# EAGLE design ECE411 V1.06 Final Draft OshPark (EAGLE 9.6.2)
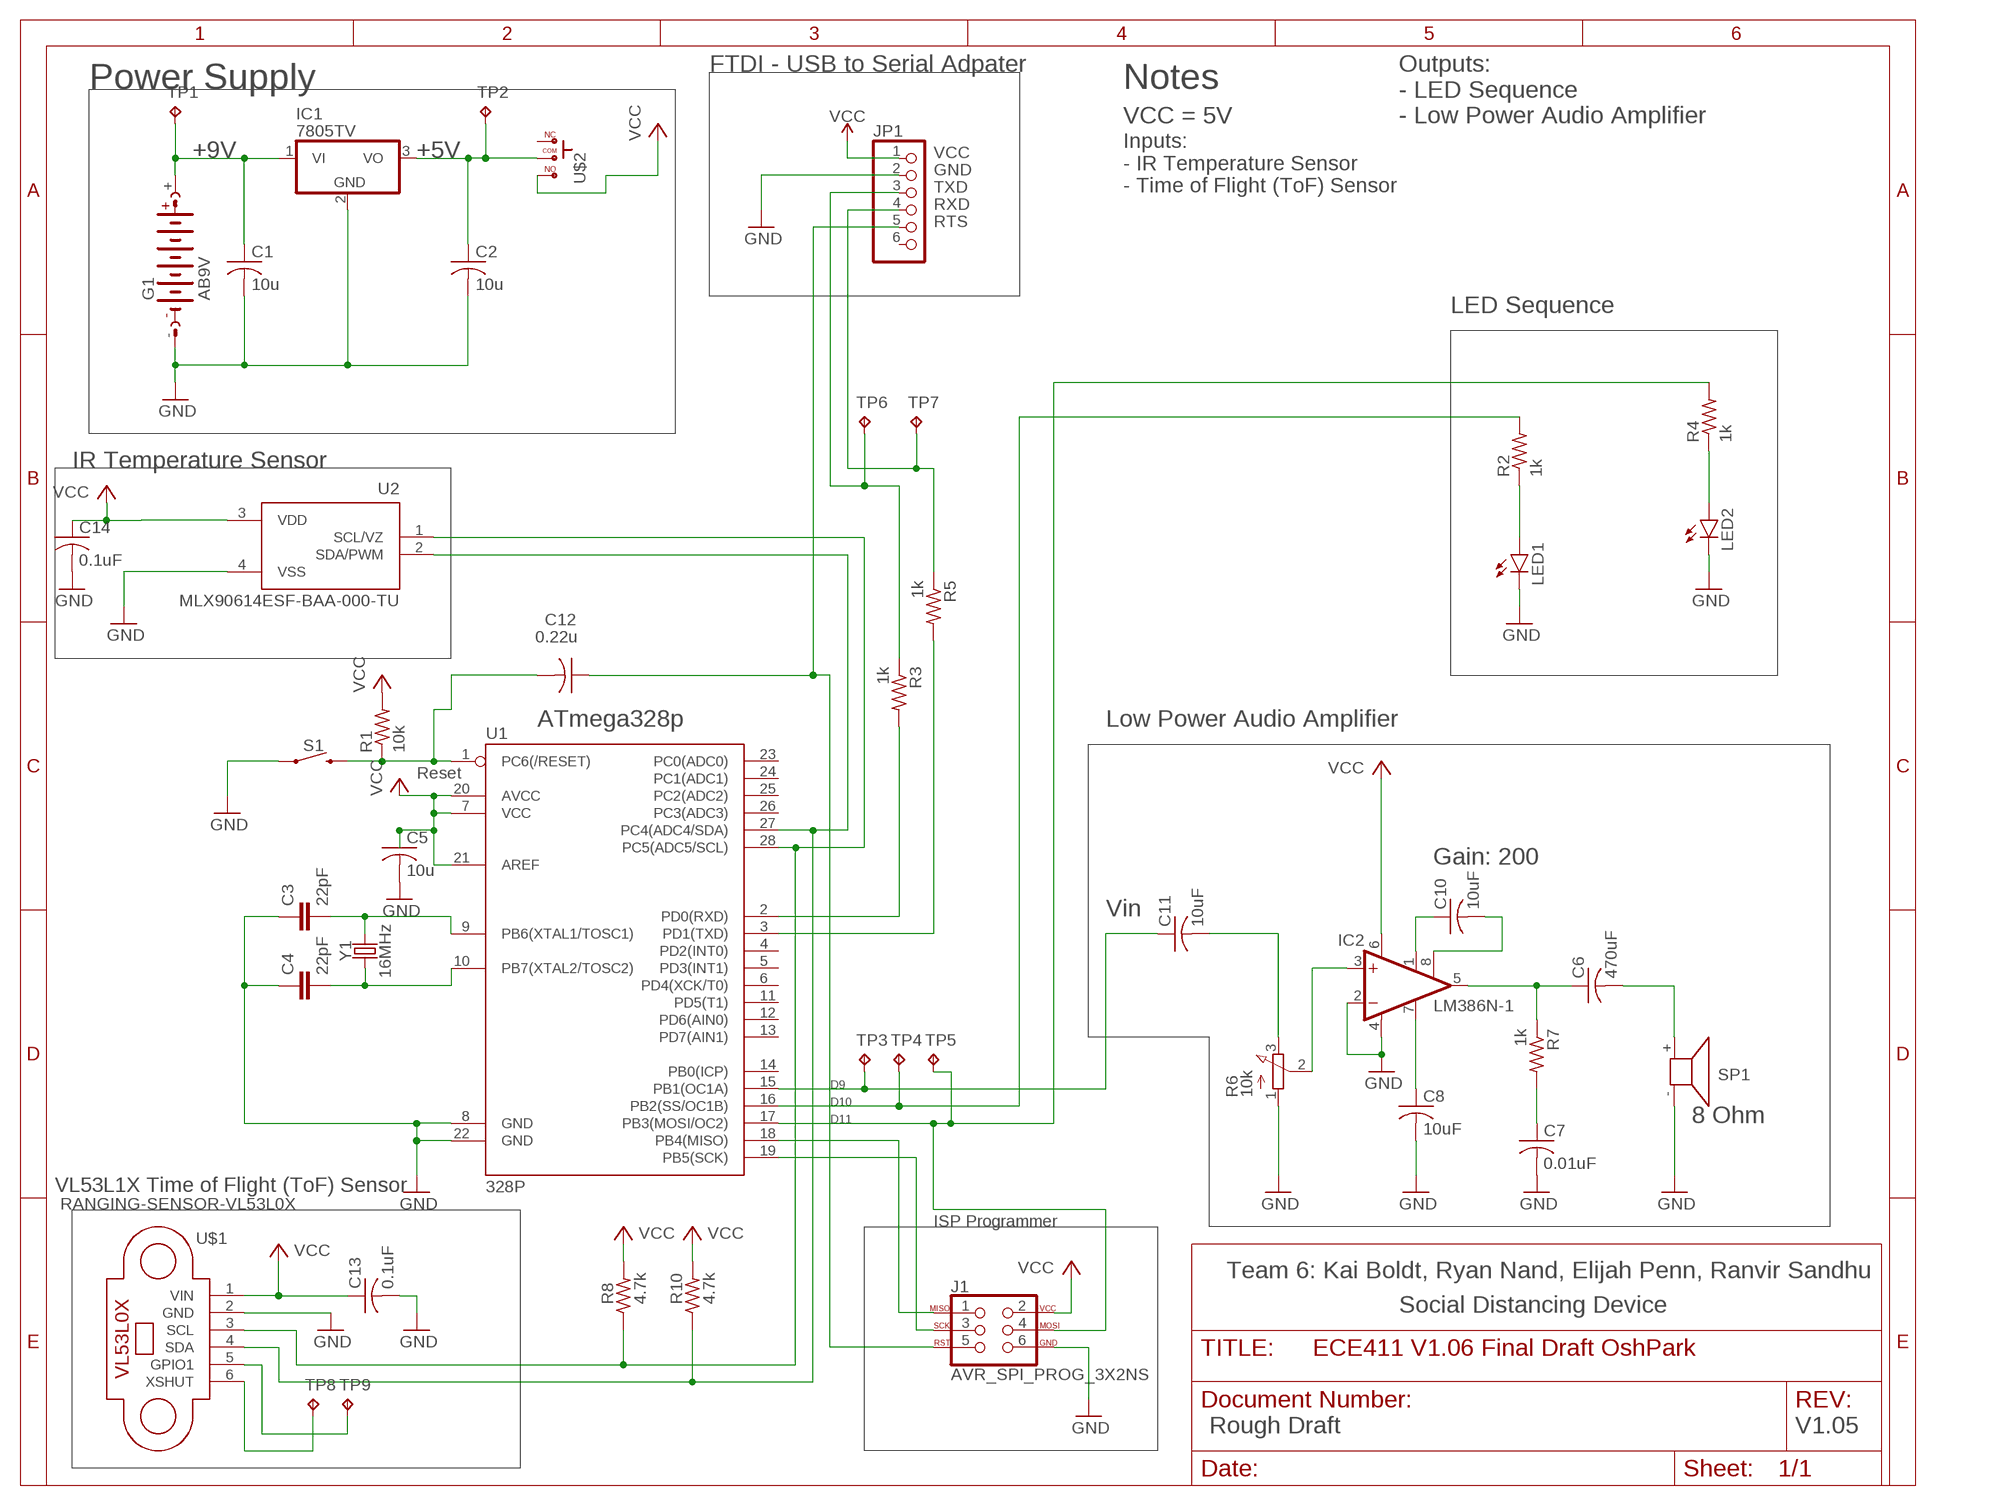
[diagram p0: schematic, sheet 1]

## Parts
C1  10u  C-US025-024X044  [C025-024X044]
C2  10u  C-US025-024X044  [C025-024X044]
C3  22pF  22PF-PTH-2.54MM-200V-5%  [CAP-PTH-2.54]
C4  22pF  22PF-PTH-2.54MM-200V-5%  [CAP-PTH-2.54]
C5  10u  C-US025-024X044  [C025-024X044]
C6  470uF  C-US050-024X044  [C050-024X044]
C7  0.01uF  C-US025-024X044  [C025-024X044]
C8  10uF  C-US025-024X044  [C025-024X044]
C10  10uF  C-US025-024X044  [C025-024X044]
C11  10uF  C-US025-024X044  [C025-024X044]
C12  0.22u  C-US050-030X075  [C050-030X075]
C13  0.1uF  C-US025-024X044  [C025-024X044]
C14  0.1uF  C-US025-024X044  [C025-024X044]
G1  AB9V  [AB9V]
IC1  7805TV  [TO220V]
IC2  LM386N-1  [DIL08]
J1  AVR_SPI_PROG_3X2NS  [2X3-NS]
JP1  PINHD-1X6  [1X06]
LED1  LED3MM  [LED3MM]
LED2  LED3MM  [LED3MM]
R1  10k  R-US_0204/7  [0204/7]
R2  1k  R-US_0204/5  [0204/5]
R3  1k  R-US_0204/7  [0204/7]
R4  1k  R-US_0204/5  [0204/5]
R5  1k  R-US_0204/7  [0204/7]
R6  10k  3RP/1610N  [3RP/1610N]
R7  1k  R-US_0204/7  [0204/7]
R8  4.7k  R-US_0204/7  [0204/7]
R10  4.7k  R-US_0204/7  [0204/7]
S1  MOMENTARY-SWITCH-SPST-PTH-6.0MM  [TACTILE_SWITCH_PTH_6.0MM]
SP1  KSS1201  [KSS1201]
TP1  TPPAD1-13  [P1-13]
TP2  TPPAD1-13  [P1-13]
TP3  TPPAD1-13  [P1-13]
TP4  TPPAD1-13  [P1-13]
TP5  TPPAD1-13  [P1-13]
TP6  TPPAD1-13  [P1-13]
TP7  TPPAD1-13  [P1-13]
TP8  TPPAD1-13  [P1-13]
TP9  TPPAD1-13  [P1-13]
U1  328P  ATMEGA328P_PDIP  [DIP28]
U2  MLX90614ESF-BAA-000-TU  [TO254P942H425-4]
U$1  RANGING-SENSOR-VL53L0X  [RANGING-SENSOR-VL53L0X]
U$2  -SLIDERS  [CON3]
Y1  16MHz  CRYSTAL-16MHZPTH-HC49US  [HC49US]

## Nets
5V: C2.1 IC1.3(VO) TP2.TP U$2.P$2
+9V: C1.1 G1.+ IC1.1(VI) TP1.TP
AUDIO: C11.1 TP3.TP U1.15(PB1(OC1A))
BYPASS: C8.1 IC2.7(BYPASS)
GAIN: C10.1 IC2.1(GAIN)
GND: C1.2 C2.2 C3.1 C4.1 C5.2 C7.2 C8.2 C13.2 C14.2 G1.- IC1.2(GND) IC2.2(-IN) IC2.4(GND) J1.6 JP1.2 LED1.K(C) LED2.K(C) R6.1(A) S1.1 SP1.- U1.8(GND) U1.22(GND) U2.4(VSS) U$1.2(GND)
GPIO1: TP9.TP U$1.5(GPIO1)
INPUT: IC2.3(+IN) R6.2(S)
LED1: R2.2 TP4.TP U1.16(PB2(SS/OC1B))
LED2: J1.4 R4.2 TP5.TP U1.17(PB3(MOSI/OC2))
N$1: C3.2 U1.9(PB6(XTAL1/TOSC1)) Y1.2
N$2: J1.1 U1.18(PB4(MISO))
N$3: C4.2 U1.10(PB7(XTAL2/TOSC2)) Y1.1
N$5: TP8.TP U$1.6(XSHUT)
N$6: J1.3 U1.19(PB5(SCK))
N$7: C7.1 R7.2
N$10: C10.2 IC2.8(GAIN)
N$13: C11.2 R6.3(E)
N$21: LED1.A R2.1
N$22: LED2.A R4.1
RESET: C12.2 R1.1 S1.3 U1.1(PC6(/RESET))
RTS: C12.1 J1.5 JP1.5
RXD: JP1.4 R5.1 R5.2 TP7.TP U1.3(PD1(TXD))
SCL: R8.1 U1.28(PC5(ADC5/SCL)) U2.1(SCL/VZ) U$1.3(SCL)
SDA: R10.1 U1.27(PC4(ADC4/SDA)) U2.2(SDA/PWM) U$1.4(SDA)
TXD: JP1.3 R3.1 R3.2 TP6.TP U1.2(PD0(RXD))
VCC: C5.1 C13.1 C14.1 IC2.6(VS) J1.2 JP1.1 R1.2 R8.2 R10.2 U1.7(VCC) U1.20(AVCC) U1.21(AREF) U2.3(VDD) U$1.1(VIN) U$2.P$3
VO: C6.2 SP1.+
VOUT: C6.1 IC2.5(OUT) R7.1
Unconnected: JP1.6 U1.4(PD2(INT0)) U1.5(PD3(INT1)) U1.6(PD4(XCK/T0)) U1.11(PD5(T1)) U1.12(PD6(AIN0)) U1.13(PD7(AIN1)) U1.14(PB0(ICP)) U1.23(PC0(ADC0)) U1.24(PC1(ADC1)) U1.25(PC2(ADC2)) U1.26(PC3(ADC3)) U$2.P$1

## Notes on the sheet
- FTDI - USB to Serial Adpater
- Power Supply | Notes
- VCC = 5V
- Outputs:
  - LED Sequence
  - Low Power Audio Amplifier
- +5V | VCC
- GND
- TXD
- Inputs:
  - IR Temperature Sensor
  - Time of Flight (ToF) Sensor
- RXD
- RTS
- LED Sequence
- IR Temperature Sensor
- ATmega328p | Low Power Audio Amplifier
- Reset
- Gain: 200
- Vin
- D9
- D10
- D11 | 8 Ohm
- VL53L1X Time of Flight (ToF) Sensor
- ISP Programmer
- Team 6: Kai Boldt, Ryan Nand, Elijah Penn, Ranvir Sandhu
- Social Distancing Device
- Rough Draft | V1.05

## Library data of the parts
C1 C2 C5-C8 C10-C14 = rcl:C-US: CAPACITOR, American symbol; SPICEPREFIX: C
C3 C4 = SparkFun-Capacitors:22PF: 22pF ceramic capacitors A capacitor is a passive two-terminal electrical component used to store electrical energy temporarily in an electric field.; PROD_ID: CAP-09128
G1 = battery:AB9V: 9-V BATTERY CLIP
IC1 = linear:78*: Positive VOLTAGE REGULATOR Source: http://cache.national.com/ds/LM/LM78L05.pdf http://www.fairchildsemi.com/ds/LM/LM7805.pdf
IC2 = linear:LM386?-*: Low Voltage Audio Power Amplifier Source: http://cache.national.com/ds/LM/LM386.pdf
J1 = SparkFun-Connectors:AVR_SPI_PROG_3X2: AVR ISP 6 Pin This is the reduced ISP connector for AVR programming. Common on Arduino. This footprint will take up less PCB space and can be used with a 10-pin to 6-pin adapter such as SKU: BOB-08508 **Special note about "TEST_POINT" package. The stop mask is on the top side, so if you want your programming test points to be on the bottom of your board, make sure to place this package on the bottom side of the board. This also ensure that the orientation to program from the bottom side will be correct. SparkFun Products: SparkFun ISP Pogo Adapter <https://www.sparkfun.com/products/11591> - NS Tiny AVR Programmer <https://www.sparkfun.com/products/11801> -PTH
JP1 = pinhead:PINHD-1X6: PIN HEADER
LED1 LED2 = led:LED: LED OSRAM: - CHIPLED LG R971, LG N971, LY N971, LG Q971, LY Q971, LO R971, LY R971 LH N974, LH R974 LS Q976, LO Q976, LY Q976 LO Q996 - Hyper CHIPLED LW Q18S LB Q993, LB Q99A, LB R99A - SideLED LS A670, LO A670, LY A670, LG A670, LP A670 LB A673, LV A673, LT A673, LW A673 LH A674 LY A675 LS A676, LA A676, LO A676, LY A676, LW A676 LS A679, LY A679, LG A679 - Hyper Micro SIDELED® LS Y876, LA Y876, LO Y876, LY Y876 LT Y87S - SmartLED LW L88C, LW L88S LB L89C, LB L89S, LG L890 LS L89K, LO L89K, LY L89K LS L896, LA L896, LO L896, LY L896 - TOPLED LS T670, LO T670, LY T670, LG T670, LP T670 LSG T670, LSP T670, LSY T670, LOP T670, LYG T670 LG T671, LOG T671, LSG T671 LB T673, LV T673, LT T673, LW T673 LH T674 LS T676, LA T676, LO T676, LY T676, LB T676, LH T676, LSB T676, LW T676 LB T67C, LV T67C, LT T67C, LS T67K, LO T67K, LY T67K, LW E67C LS E67B, LA E67B, LO E67B, LY E67B, LB E67C, LV E67C, LT E67C LW T67C LS T679, LY T679, LG T679 LS T770, LO T770, LY T770, LG T770, LP T770 LB T773, LV T773, LT T773, LW T773 LH T774 LS E675, LA E675, LY E675, LS T675 LS T776, LA T776, LO T776, LY T776, LB T776 LHGB T686 LT T68C, LB T68C - Hyper Mini TOPLED® LB M676 - Mini TOPLED Santana® LG M470 LS M47K, LO M47K, LY M47K Source: http://www.osram.convergy.de LUXEON: - LUMILED® LXK2-PW12-R00, LXK2-PW12-S00, LXK2-PW14-U00, LXK2-PW14-V00 LXK2-PM12-R00, LXK2-PM12-S00, LXK2-PM14-U00 LXK2-PE12-Q00, LXK2-PE12-R00, LXK2-PE12-S00, LXK2-PE14-T00, LXK2-PE14-U00 LXK2-PB12-K00, LXK2-PB12-L00, LXK2-PB12-M00, LXK2-PB14-N00, LXK2-PB14-P00, LXK2-PB14-Q00 LXK2-PR12-L00, LXK2-PR12-M00, LXK2-PR14-Q00, LXK2-PR14-R00 LXK2-PD12-Q00, LXK2-PD12-R00, LXK2-PD12-S00 LXK2-PH12-R00, LXK2-PH12-S00 LXK2-PL12-P00, LXK2-PL12-Q00, LXK2-PL12-R00 Source: www.luxeon.com KINGBRIGHT: KA-3528ASYC Source: www.kingbright.com
R1-R5 R7 R8 R10 = rcl:R-US_: RESISTOR, American symbol; SPICEPREFIX: R
R6 = pot:3RP/1610N: 16mm Potentiometer one level Source: http://www.alphapotentiometers.net/html/16mm_pot_2.html
S1 = SparkFun-Switches:MOMENTARY-SWITCH-SPST: Momentary Switch (Pushbutton) - SPST Normally-open (NO) SPST momentary switches (buttons, pushbuttons). Variants PTH-12MM - 12mm square, through-hole Momentary Pushbutton Switch - 12mm Square <https://www.sparkfun.com/products/9190> (COM-09190) PTH-6.0MM, PTH-6.0MM-KIT - 6.0mm square, through-hole Mini Pushbutton Switch <https://www.sparkfun.com/products/97> (COM-00097) KIT package intended for soldering kit's - only one side of pads' copper is exposed. PTH-RIGHT-ANGLE-KIT - Right-angle, through-hole Right Angle Tactile Button <https://www.sparkfun.com/products/10791> - Used on SparkFun BigTime Watch Kit <https://www.sparkfun.com/products/11734> SMD-12MM - 12mm square, surface-mount Tactile Button - SMD (12mm) <https://www.sparkfun.com/products/12993> (COM-12993) Used on SparkFun PicoBoard <https://www.sparkfun.com/products/11888> SMD-4.5MM - 4.5mm Square Trackball Switch Used on SparkFun Blackberry Trackballer Breakout <https://www.sparkfun.com/products/13169> SMD-4.6MMX2.8MM - 4.60mm x 2.80mm, surface mount Used on SparkFun SAMD21 Mini Breakout <https://www.sparkfun.com/products/13664> SMD-5.2MM, SMD-5.2-REDUNDANT - 5.2mm square, surface-mount Mini Pushbutton Switch - SMD <https://www.sparkfun.com/products/8720> (COM-08720) Used on Arduino Pro Mini <https://www.sparkfun.com/products/11114> REDUNDANT package connects both switch circuits together SMD-6.0X3.5MM - 6.0 x 3.5mm, surface mount Momentary Reset Switch SMD <https://www.sparkfun.com/products/8229> (COM-08229) SMD-6.2MM-TALL - 6.2mm square, surface mount Tactile Button - SMD (6mm) <https://www.sparkfun.com/products/12992> Used on SparkFun Digital Sandbox <https://www.sparkfun.com/products/12651> SMD-RIGHT-ANGLE - Right-angle, surface mount Used on SparkFun Block for Intel® Edison - Arduino <https://www.sparkfun.com/products/13036>; PROD_ID: SWCH-08441; SF_SKU: COM-00097
SP1 = buzzer:KSS1201: SPEAKER Source: Schukat; OC_FARNELL: unknown; OC_NEWARK: unknown
TP1-TP9 = testpad:TP: Test pad
U1 = SparkFun-IC-Microcontroller:ATMEGA328P_PDIP: Atmel 328P Through hole ATMEGA328P uC used in the Arduino 32kb flash, 1k EEPROM, 2k SRAM Datasheet <http://www.sparkfun.com/datasheets/Components/SMD/ATMega328.pdf> SparkFun Products Storefront component: AVR 28 Pin 20MHz 32K 6A/D - ATMega328P <https://www.sparkfun.com/products/9061> (COM-09061) SparkFun Simon Says - Through-Hole Soldering Kit <https://www.sparkfun.com/products/10547> (KIT-10547) SparkFun Learn to Solder - Simon Says <https://www.sparkfun.com/products/13708> (KIT-13708) SparkFun BigTime Watch Kit <https://www.sparkfun.com/products/11734> (KIT-11734) SparkFun ClockIt <https://www.sparkfun.com/products/10930> (KIT-10930) SparkFun Serial Enabled LCD Kit <https://www.sparkfun.com/products/10097> (LCD-10097) SparkFun Simon Tilts - Through Hole Soldering Kit <https://www.sparkfun.com/products/12634> (KIT-12634) SparkFun Frequency Counter Kit <https://www.sparkfun.com/products/10140> (KIT-10140) FabFM Radio Kit <https://www.sparkfun.com/products/11043> (KIT-11043) SparkFun Binary Blaster Kit <https://www.sparkfun.com/products/12037> (KIT-12037) SparkFun Metro-Gnome <https://www.sparkfun.com/products/9236> (KIT-09236) ATmega328 with Arduino Optiboot (Uno) <https://www.sparkfun.com/products/10524> (DEV-10524); PROD_ID: IC-09136
U2 = MLX90614ESF-BAA-000-TU:MLX90614ESF-BAA-000-TU: Temperature Sensor Digital, Infrared (IR) -40°C ~ 85°C 16 b TO-39 Check prices <https://pricing.snapeda.com/parts/MLX90614ESF-BAA-000-TU/Melexis/view-part?ref=eda>; AVAILABILITY: Warning; DESCRIPTION: Temperature Sensor Digital, Infrared (IR) -40°C ~ 85°C 16 b TO-39; MF: Melexis; MP: MLX90614ESF-BAA-000-TU; PACKAGE: TO-39 Melexis; PRICE: None; PURCHASE-URL: https://pricing.snapeda.com/search/part/MLX90614ESF-BAA-000-TU/?ref=eda
U$1 = VL53L0X:RANGING-SENSOR-VL53L0X: Laser Ranging Sensor based on VL53L0X device More information about VL53L0X device can be found here: http://www.st.com/en/imaging-and-photonics-solutions/vl53l0x.html Arduino Library for VL53L0X is available here: https://github.com/pololu/vl53l0x-arduino Click here to find device on ebay.com <http://www.ebay.com/sch/GY+VL53L0X+module> Note: There are many variants. Search for the proper version.
U$2 = tango:-SLIDERS
Y1 = SparkFun-Clocks:CRYSTAL-16MHZ: 16MHz Crystal Digikey Example <http://www.digikey.com/product-search/en?keywords=535-9122-1-ND> Frequency: 16MHz Frequency Stability: ±50ppm Frequency Tolerance: ±20ppm Load Capacitance: 18pF SparkFun Products: Pro Micro -5V/16MHz <https://www.sparkfun.com/products/12640> SparkFun Serial Enabled LCD Kit <https://www.sparkfun.com/products/10097>; PROD_ID: XTAL-08181; SF_ID: COM-00536

## Board
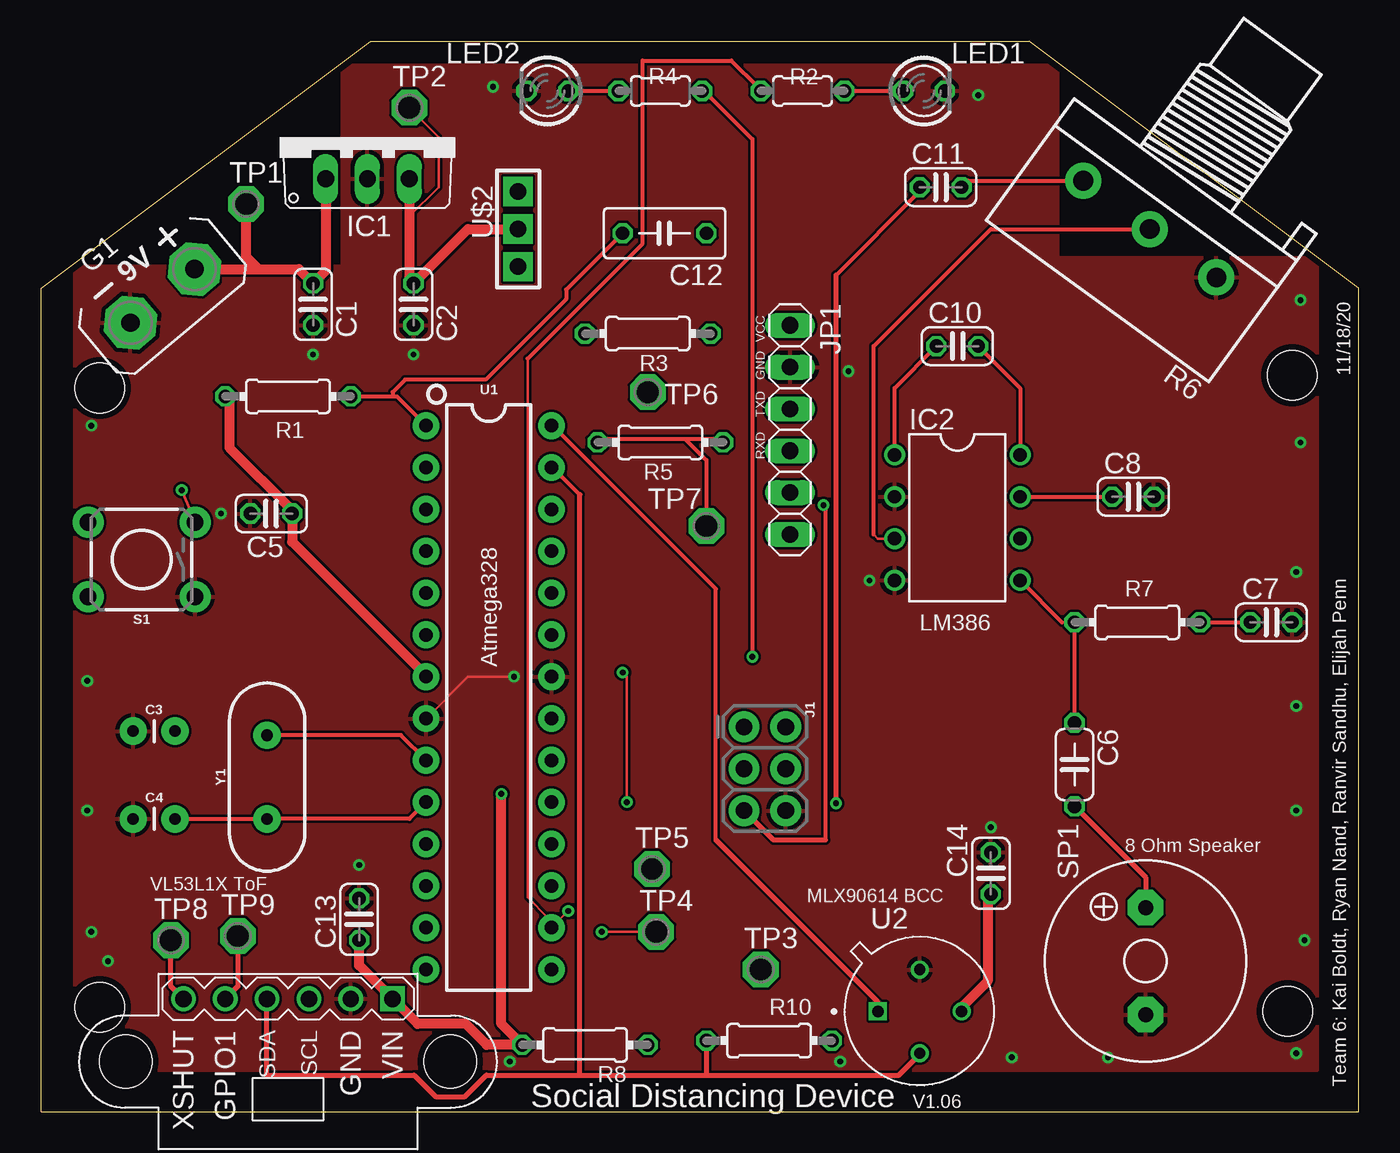
[diagram p1: board, top side]
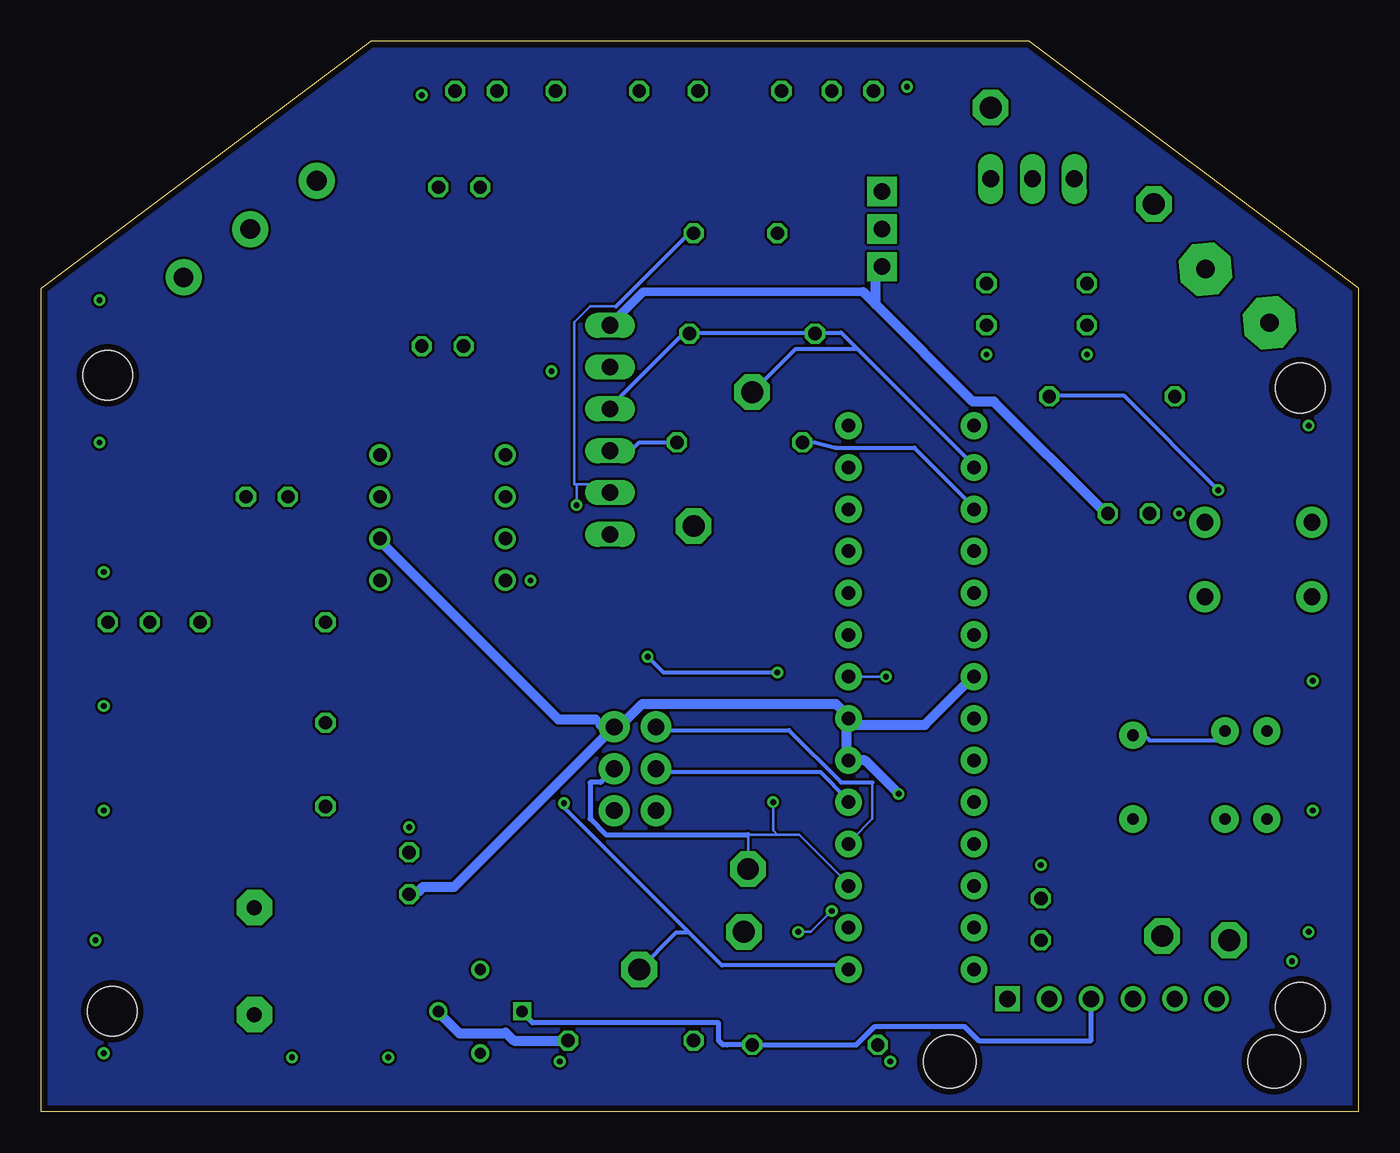
[diagram p2: board, bottom side, seen from below]

Size 80 x 65 mm. Coordinates in mm from the lower left corner, seen from the top.
Outline: 0,0 80,0 80,50 60,65 20,65 0,50 0,0
Copper layers (1*16): Top 0.0356mm / dielectric 1.5011mm / Bottom 0.0356mm
Design rules "LaenPCBOrder": minimum track width 6mil, minimum drill 13mil, track to track 6mil, track to pad 6mil, pad to pad 6mil, via to via 6mil, smd to smd 6mil, copper to edge 15mil, drill to drill 6mil, minimum pad ring 7mil, minimum via ring 7mil, stop-mask expansion 3mil, vias tented up to drill 0mil, thermal gap 10mil
Holes 3 mm at 75.69,6.1 3.56,6.35 75.95,44.7 3.56,43.94

### Footprints (pad centres in the part's own frame; a part is rotated, then mirrored left to right if it is on the bottom)
C025-024X044 = drill 0.813 octagon: 1 -1.27,0; 2 1.27,0
CAP-PTH-2.54 = drill 0.7 pad 1.651: 1 -1.27,0; 2 1.27,0
C050-024X044 = drill 0.813 octagon: 1 -2.54,0; 2 2.54,0
C050-030X075 = drill 0.813 octagon: 1 -2.54,0; 2 2.54,0
AB9V = drill 1.118 pad 3.15 octagon: + 0,2.54; - 0,-2.54
TO220V = drill 1.016 long: 1 -2.54,-2.54; 2 0,-2.54; 3 2.54,-2.54
DIL08 = drill 0.813 pad 1.27: 1 -3.81,-3.81; 2 -1.27,-3.81; 3 1.27,-3.81; 4 3.81,-3.81; 5 3.81,3.81; 6 1.27,3.81; 7 -1.27,3.81; 8 -3.81,3.81
2X3-NS = drill 1.016 pad 1.88: 1 -2.54,-1.27; 2 -2.54,1.27; 3 0,-1.27; 4 0,1.27; 5 2.54,-1.27; 6 2.54,1.27
1X06 = drill 1.016 long: 1 -6.35,0; 2 -3.81,0; 3 -1.27,0; 4 1.27,0; 5 3.81,0; 6 6.35,0
LED3MM = drill 0.813 octagon: A -1.27,0; K 1.27,0
0204/7 = drill 0.813 octagon: 1 -3.81,0; 2 3.81,0
0204/5 = drill 0.813 octagon: 1 -2.54,0; 2 2.54,0
3RP/1610N = drill 1.2 pad 2.184: 1 -5,0; 2 0,0; 3 5,0
TACTILE_SWITCH_PTH_6.0MM = drill 1.016 pad 1.88: 1 -3.251,2.261; 2 3.251,2.261; 3 -3.251,-2.261; 4 3.251,-2.261
KSS1201 = drill 0.914 pad 2.159 octagon: + 3.251,0; - -3.251,0
P1-13 = drill 1.321 pad 2.159 octagon: TP 0,0
DIP28 = drill 0.813 pad 1.626: 1 -16.51,-3.81; 2 -13.97,-3.81; 3 -11.43,-3.81; 4 -8.89,-3.81; 5 -6.35,-3.81; 6 -3.81,-3.81; 7 -1.27,-3.81; 8 1.27,-3.81; 9 3.81,-3.81; 10 6.35,-3.81; 11 8.89,-3.81; 12 11.43,-3.81; 13 13.97,-3.81; 14 16.51,-3.81; 15 16.51,3.81; 16 13.97,3.81; 17 11.43,3.81; 18 8.89,3.81; 19 6.35,3.81; 20 3.81,3.81; 21 1.27,3.81; 22 -1.27,3.81; 23 -3.81,3.81; 24 -6.35,3.81; 25 -8.89,3.81; 26 -11.43,3.81; 27 -13.97,3.81; 28 -16.51,3.81
TO254P942H425-4 = drill 0.69 pad 1.09 square: 1 -2.54,0 | drill 0.69 pad 1.09: 2 0,-2.54; 3 2.54,0; 4 0,2.54
RANGING-SENSOR-VL53L0X = drill 1 square: 1 -3.81,6.35 | drill 1: 2 -3.81,3.81; 3 -3.81,1.27; 4 -3.81,-1.27; 5 -3.81,-3.81; 6 -3.81,-6.35 | hole 3.2: 0,9.85; 0,-9.85
CON3 = drill 1 pad 1.778 square: P$1 -2.794,0.254; P$2 -0.508,0.254; P$3 1.778,0.254
HC49US = drill 0.7 pad 1.651: 1 -2.54,0; 2 2.54,0

### Placement (x,y rotation side)
C1  16.51,49.02 270 top
C2  22.61,49.02 270 top
C3  6.86,23.11 0 top
C4  6.86,17.78 0 top
C5  13.97,36.32 180 top
C6  62.74,21.08 270 top
C7  74.68,29.72 0 top
C8  66.29,37.34 0 top
C10  55.63,46.48 0 top
C11  54.61,56.13 0 top
C12  37.85,53.34 180 top
C13  19.3,11.68 90 top
C14  57.66,14.48 90 top
G1  7.37,49.53 309.8 top
IC1  19.81,59.18 0 top
IC2  55.63,36.07 270 top
J1  43.94,20.83 270 top
JP1  45.47,41.4 270 top
LED1  53.59,61.98 0 top
LED2  30.73,61.98 180 top
R1  14.99,43.43 180 top
R2  46.23,61.98 180 top
R3  36.83,47.24 180 top
R4  37.59,61.98 0 top
R5  37.59,40.64 180 top
R6  67.31,53.59 144 top
R7  66.55,29.72 0 top
R8  33.02,4.06 180 top
R10  44.2,4.32 0 top
S1  6.1,33.53 180 top
SP1  67.06,9.14 90 top
TP1  12.45,55.12 0 top
TP2  22.35,60.96 0 top
TP3  43.69,8.64 0 top
TP4  37.34,10.92 0 top
TP5  37.08,14.73 0 top
TP6  36.83,43.69 0 top
TP7  40.39,35.56 0 top
TP8  7.87,10.41 0 top
TP9  11.94,10.67 0 top
U1  27.18,25.15 270 top
U2  53.34,6.1 0 top
U$1  14.99,3.05 270 top
U$2  28.7,53.09 270 top
Y1  13.72,20.32 90 top

### Tracks (layer width: path | path; a pad name or v marks a point on that pad's centre or on a via)
5V
  Top 0.152: 22.35,50.55 C2.1 | 22.35,54.36 24.13,56.13 24.13,59.18 TP2.TP
  Top 0.61: IC1.3 22.35,54.36 22.35,50.55 | C2.1 25.91,53.59 U$2.P$2
+9V
  Top 0.61: IC1.1 17.27,51.05 C1.1 15.65,51.16 13.21,51.16 | G1.+ 13.21,51.16 | 13.21,51.16 12.45,51.92 TP1.TP
AUDIO  (via drill 0.35)
  Top 0.152: 53.34,55.88 C11.1
  Top 0.254: 48.26,50.8 53.34,55.88
  Top 0.305: v48.26,18.73 48.26,50.8
  Bottom 0.254: 40.67,10.89 38.67,8.89 31.11,8.89 U1.15 | 48.26,18.48 40.67,10.89 | TP3.TP 41.43,10.89 40.67,10.89
  Bottom 0.305: 48.26,18.48 v48.26,18.73
BYPASS
  Top 0.254: IC2.7 C8.1
GAIN
  Top 0.254: C10.1 51.82,43.94 IC2.1
GND  (via drill 0.35)
  Top 0.152: U1.8 25.91,26.42 v28.7,26.42
  Bottom 0.152: v28.7,26.42 U1.22
  other vias: 3.05,41.66 2.79,26.16 2.79,18.29 3.05,10.92 4.06,9.14 76.45,49.28 76.45,40.64 76.2,32.77 76.2,24.64 76.2,18.29 76.71,10.41 76.2,3.56 64.77,3.3 58.93,3.3 28.45,3.05 48.51,3.05 10.92,36.32 16.51,45.97 22.61,45.97 49.02,44.96 56.9,61.72 27.43,62.23 50.29,32.26 57.66,17.27 19.3,14.99
  pour Top: 2.03,2.54 77.47,2.54 77.47,51.82 61.72,51.82 61.72,63.5 18.29,63.5 18.29,51.31 2.03,51.31
GPIO1
  Top 0.305: TP9.TP 11.94,7.62 U$1.5
INPUT
  Top 0.152: IC2.3 50.8,34.8 50.55,35.05
  Top 0.254: 50.55,35.05 50.55,46.48 57.66,53.59 R6.2
LED1  (via drill 0.35)
  Top 0.152: 29.53,45.72 29.53,13.02 30.8,11.75 30.8,11.43 U1.16 v32,12.19 | 43.5,62.23 R2.2 | TP4.TP v34.04,10.92
  Top 0.254: 43.5,62.23 41.91,63.82 36.51,63.82 36.51,52.7 29.53,45.72
  Bottom 0.152: v34.04,10.92 33.27,10.92 v32,12.19
LED2  (via drill 0.35)
  Top 0.152: 40.32,61.91 R4.2 | v35.31,26.67 35.56,26.42 v35.56,18.8
  Top 0.254: 40.32,61.91 43.18,59.05 v43.18,27.62
  Bottom 0.152: 35.31,16.83 37.08,16.83 TP5.TP | 35.31,16.83 33.97,16.83 31.11,13.97 U1.17 | v35.56,18.8 35.56,17.08 35.31,16.83
  Bottom 0.254: v43.18,27.62 42.23,26.67 v35.31,26.67
  Bottom 0.305: 37.08,16.83 45.72,16.83 46.67,17.78 46.67,20 46.04,20 J1.4
N$1
  Top 0.254: U1.9 21.84,22.86 Y1.2
  Bottom 0.254: Y1.2 13.02,22.86 12.7,22.54 8.57,22.54 8.26,22.86 C3.2
N$2
  Bottom 0.152: 29.53,20 29.53,17.78 30.8,16.51 U1.18 | 42.55,23.18 J1.1
  Bottom 0.254: 29.53,20 31.43,20 34.61,23.18 42.55,23.18
N$3
  Top 0.254: U1.10 22.35,17.78 Y1.1 C4.2
N$4
  pour Bottom: 80,0 0,0 0,50 20,65 60,65 80,50
N$5
  Top 0.305: U$1.6 7.87,7.62 TP8.TP
N$6
  Bottom 0.152: 31.11,19.05 U1.19 | 42.55,20.64 J1.3
  Bottom 0.254: 31.11,19.05 32.7,20.64 42.55,20.64
N$7
  Top 0.254: R7.2 C7.1
N$10
  Top 0.254: C10.2 59.44,43.94 IC2.8
N$13
  Top 0.254: C11.2 56.28,56.53 R6.3
N$21
  Top 0.254: R2.1 LED1.A
N$22
  Top 0.254: LED2.A R4.1
RESET  (via drill 0.35)
  Top 0.152: v8.53,37.74 S1.3
  Top 0.254: R1.1 21.34,43.43 | 21.34,43.43 21.59,43.43 U1.1 | C12.2 31.88,49.91 31.88,49.34 26.98,44.45 22.1,44.45 21.34,43.69 21.34,43.43
  Bottom 0.152: 18.73,43.5 R1.1
  Bottom 0.254: v8.53,37.74 14.29,43.5 18.73,43.5
RTS  (via drill 0.35)
  Top 0.152: 47.62,36.7 v47.5,36.83
  Top 0.254: 47.62,16.51 47.62,36.7
  Top 0.305: J1.5 44.45,16.51 47.62,16.51
  Bottom 0.152: 45.09,48.9 46.67,48.9 47.62,47.94 47.62,38.1 47.5,38.1 | 47.5,38.1 46.04,38.1 45.72,37.78 JP1.5 | 40.64,53.34 C12.1 | v47.5,36.83 47.5,38.1
  Bottom 0.254: 45.09,48.9 40.64,53.34
RXD
  Top 0.254: 39.12,40.83 40.89,40.83 41.08,40.64 R5.1 | 39.12,40.83 33.97,40.83 R5.2 | 39.12,40.83 40.39,39.56 TP7.TP
  Bottom 0.254: U1.3 23.5,36.83 26.99,40.32 31.75,40.32 33.02,40.64 R5.2 | R5.1 43.69,40.64 44.2,40.13 JP1.4
SCL
  Top 0.152: 31.11,41.59 U1.28
  Top 0.254: 31.11,41.59 40.96,31.75 40.96,16.51
  Top 0.305: 40.96,16.51 50.8,6.67 U2.1
  Bottom 0.152: 50.8,6.03 U2.1
  Bottom 0.305: 50.8,6.03 50.16,5.4 38.86,5.4 38.86,4.32 38.61,4.06 38.35,4.06 R8.1 30.5,4.06 29.39,5.18 23.95,5.18 23.09,4.32 16.26,4.32 U$1.3
SDA
  Top 0.152: 53.34,3.49 U2.2 | 31.11,39.05 U1.27
  Top 0.254: 32.7,37.47 31.11,39.05
  Top 0.305: 53.34,3.49 52.07,2.22 40.39,2.22 | 32.7,2.22 40.39,2.22 | U$1.4 13.65,6.77 13.65,2.22 22.64,2.22 23.95,0.92 25.72,0.92 27.03,2.22 32.7,2.22 | 32.7,2.22 32.7,37.47 | R10.1 40.39,2.22
TXD
  Bottom 0.152: 40.64,47.31 R3.1 | 45.4,42.86 JP1.3 | 23.5,39.37 U1.2 | 33.02,47.31 R3.2
  Bottom 0.254: 40.64,47.31 33.02,47.31 31.43,47.31 30.42,46.29 | 45.4,42.86 41.27,46.99 40.64,46.99 R3.1 | 30.42,46.29 23.5,39.37 | 30.42,46.29 34.23,46.29 TP6.TP
VCC  (via drill 0.35)
  Top 0.152: 15.24,36.51 C5.1 | 23.18,26.67 U1.7 | 55.88,6.35 U2.3 | 57.47,13.02 C14.1
  Top 0.61: 15.24,36.51 11.43,40.32 11.43,43.18 R1.2 | 23.18,26.67 15.24,34.61 C5.1 | 55.88,6.35 57.47,7.94 57.47,13.02 | v27.94,19.3 27.94,5.33 R8.2 27.05,4.06 25.78,5.33 22.86,5.33 U$1.1 19.3,8.89 C13.1
  Bottom 0.152: 31.11,21.59 U1.20 | 31.11,23.81 U1.21 | 31.11,23.5 U1.21 | 15.56,36.51 15.24,36.51 C5.1 | 46.04,23.5 46.35,23.81 | 59.37,34.61 IC2.6 | 45.4,23.5 J1.2 | 55.88,6.03 U2.3 | 57.47,13.34 57.15,13.34 | 31.11,24.13 U1.21
  Bottom 0.508: JP1.1 43.43,49.78 30.1,49.78
  Bottom 0.61: 31.11,23.81 31.11,23.5 | 31.11,23.5 31.11,21.59 | 31.11,23.5 26.35,23.5 23.5,26.35 U1.7 | 29.34,49.02 23.43,43.12 22.16,43.12 15.56,36.51 | 59.37,34.61 48.58,23.81 46.35,23.81 | 45.4,23.5 46.04,23.5 | 55.88,6.03 54.61,4.76 51.88,4.76 51.82,4.83 51.31,4.32 R10.2 | 57.15,13.34 56.83,13.65 54.93,13.65 J1.2 45.09,23.5 44.77,23.5 43.5,24.77 31.75,24.77 31.11,24.13 | 57.47,13.34 C14.1 | v27.94,19.3 29.97,21.34 U1.20 | 29.34,49.02 29.34,50.93 U$2.P$3 | 30.1,49.78 29.34,49.02
VO
  Top 0.305: C6.2 67.06,14.22 SP1.+
VOUT
  Top 0.152: 61.98,29.72 R7.1
  Top 0.254: C6.1 R7.1 | IC2.5 61.98,29.72

### Text on the board
tPlace: VCC | 11/18/20 | GND | TXD | RXD | Atmega328 | LM386 | 8 Ohm Speaker | VL53L1X ToF | MLX90614 BCC | Team 6: Kai Boldt, Ryan Nand, Ranvir Sandhu, Elijah Penn | V1.06 | Social Distancing Device